# Altium project ServoController_ADVersion.PrjPcb
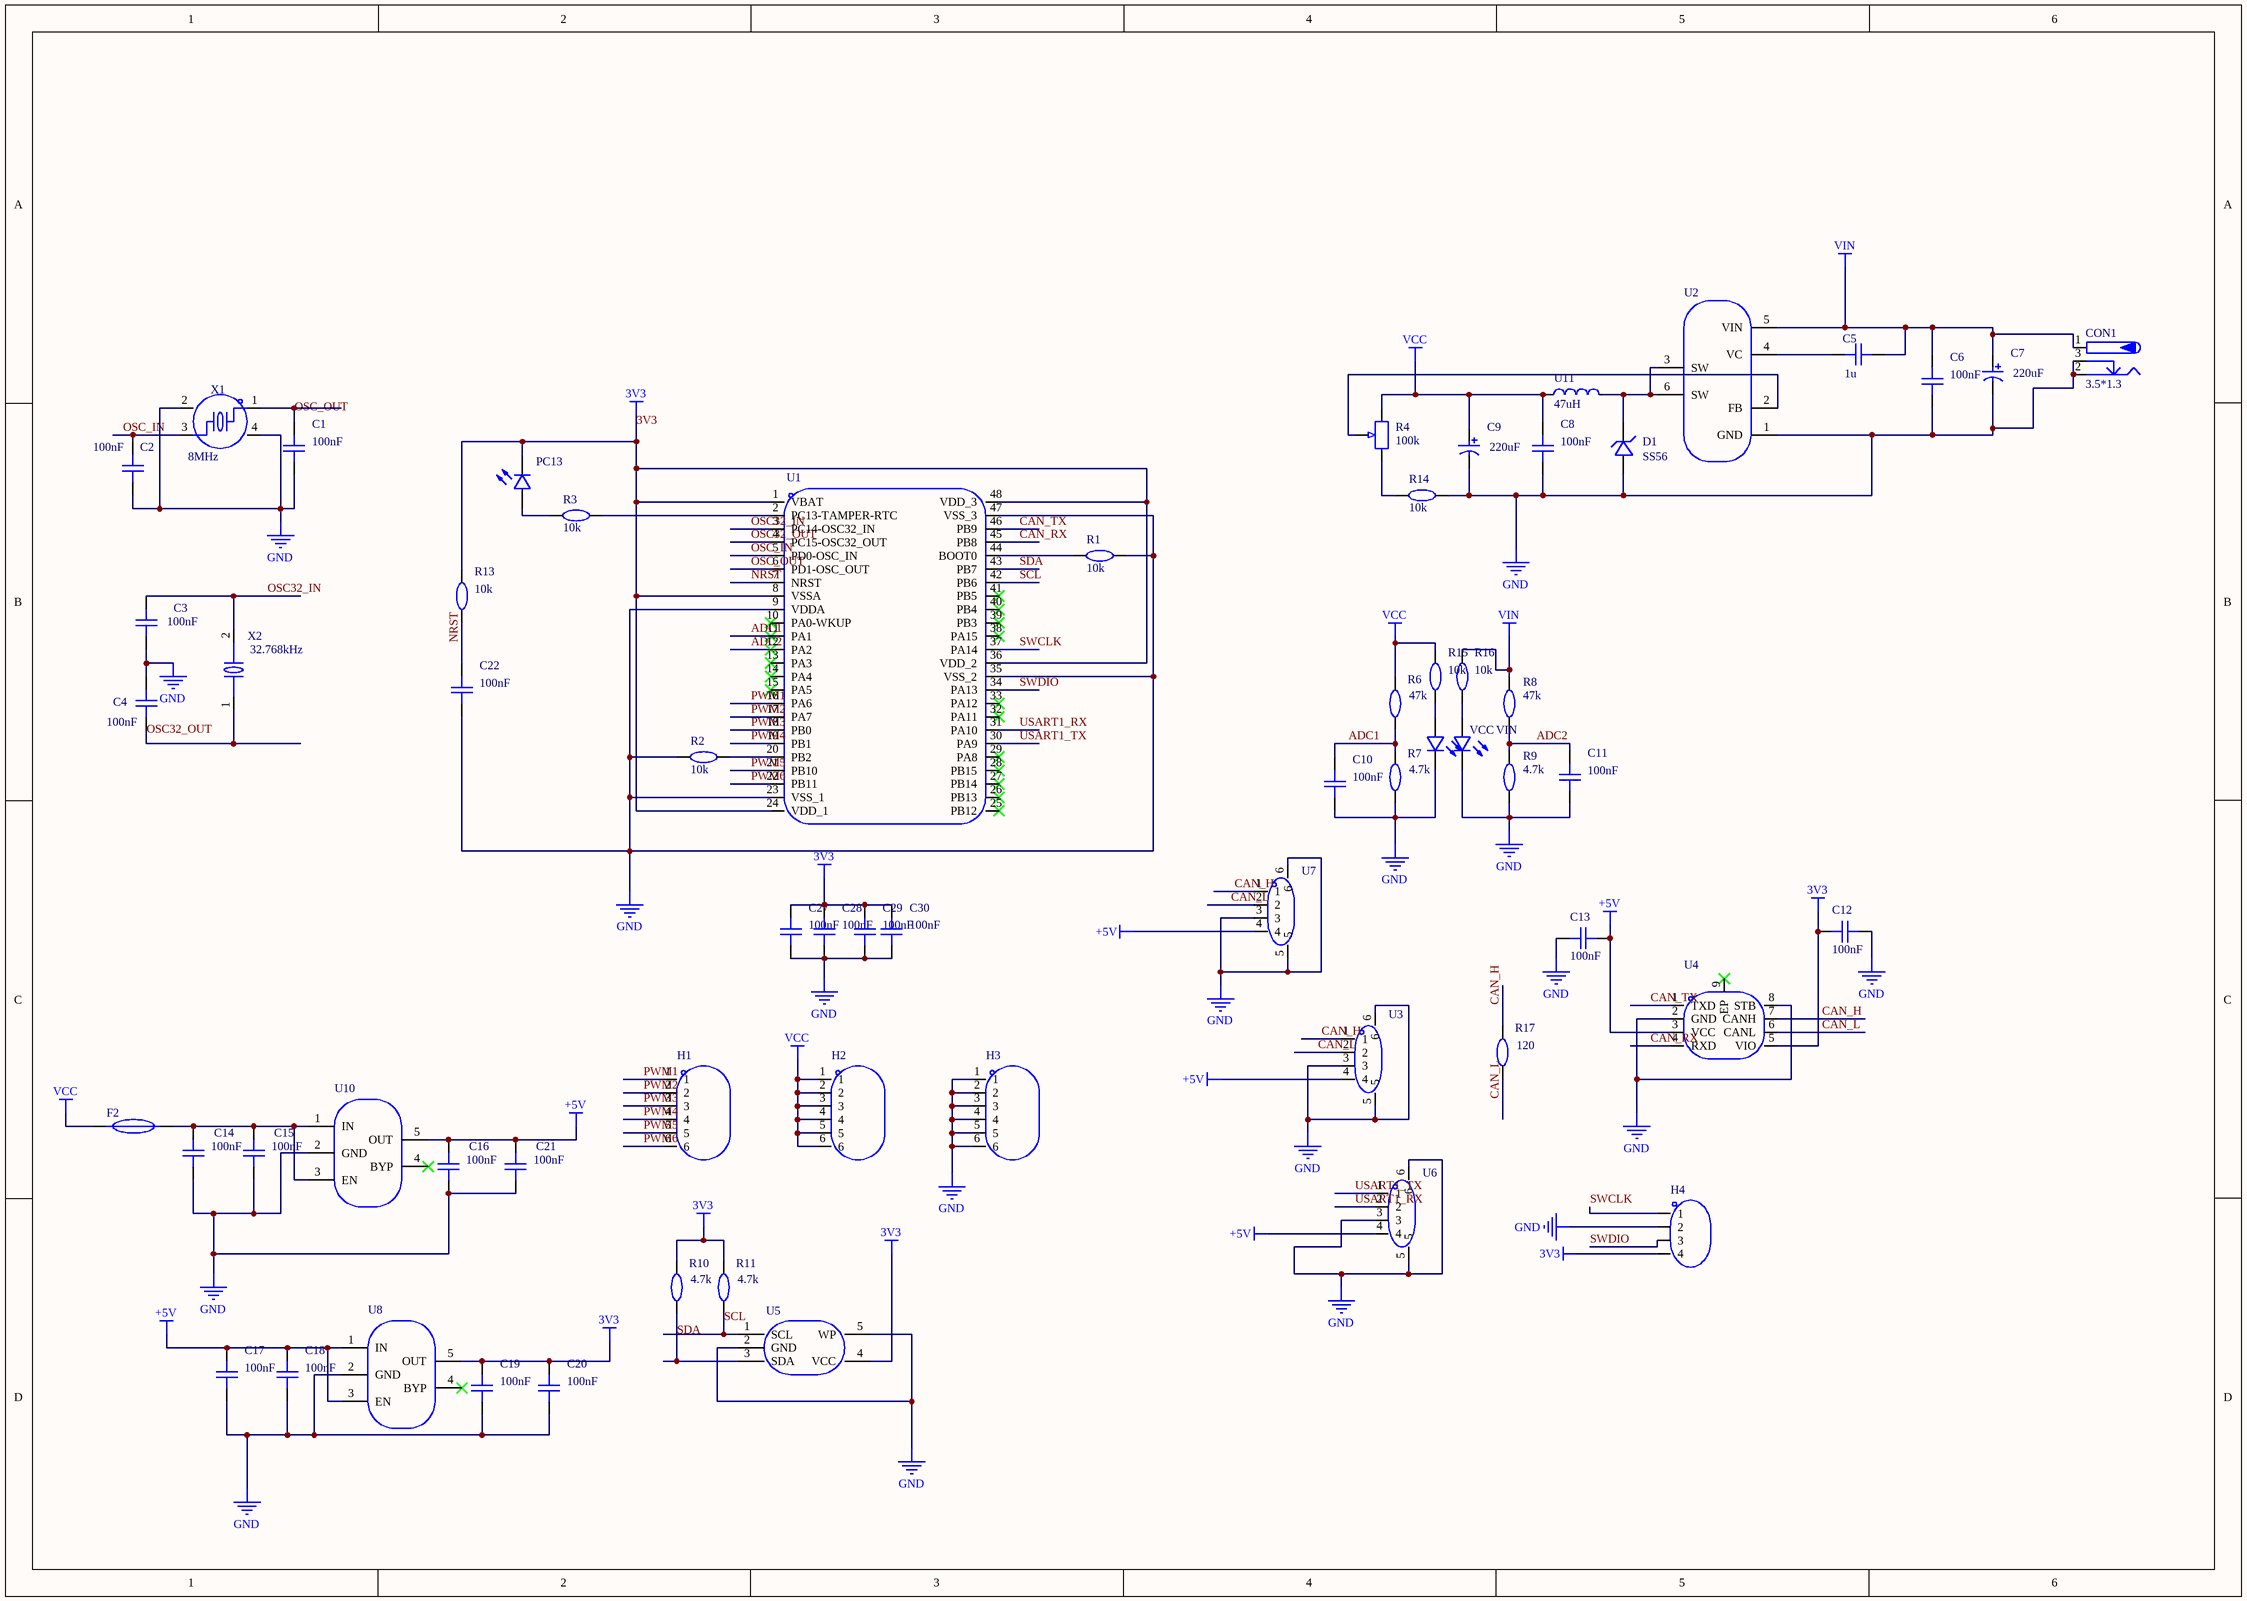
[diagram p0: 1_P1.schdoc]
1 sheet, 63 parts. Net scope: global (net labels, ports and power ports of the same name join across sheets).
Board file: PCB.PcbDoc

## Sheet 1_P1.schdoc
size 423 x 300 mm; SheetNumber: 1; SheetTotal: 1

### Parts
C1  value 100nF  [C0603_M]
C2  value 100nF  [C0603_M]
C3  value 100nF  [C0603_M]
C4  value 100nF  [C0603_M]
C5  value 1u  [C0603_M]
C6  value 100nF  [C0603_M]
C7  value 220uF  [CE D(6.3*5.4)]
C8  value 100nF  [C0603_M]
C9  value 220uF  [CE D(6.3*5.4)]
C10  value 100nF  [C0603_M]
C11  value 100nF  [C0603_M]
C12  value 100nF  [C0603_M]
C13  value 100nF  [C0603_M]
C14  value 100nF  [C0603_M]
C15  value 100nF  [C0603_M]
C16  value 100nF  [C0603_M]
C17  value 100nF  [C0603_M]
C18  value 100nF  [C0603_M]
C19  value 100nF  [C0603_M]
C20  value 100nF  [C0603_M]
C21  value 100nF  [C0603_M]
C22  value 100nF  [C0603_M]
C27  value 100nF  [C0603_M]
C28  value 100nF  [C0603_M]
C29  value 100nF  [C0603_M]
C30  value 100nF  [C0603_M]
CON1  3.5*1.3  [DC-005]
D1  LCSC Part Name: SS56  [SMA]
F2  (no value)  [FU 1206]
H1  (no value)  [HDR2.54-LI-6P]
H2  (no value)  [HDR2.54-LI-6P]
H3  (no value)  [HDR2.54-LI-6P]
H4  (no value)  [HDR2.54-LI-4P]
PC13  (no value)  [LED0603_R]
R1  value 10k  [R0603_M]
R2  value 10k  [R0603_M]
R3  value 10k  [R0603_M]
R4  value 100k  [3296W]
R6  value 47k  [R0603_M]
R7  value 4.7k  [R0603_M]
R8  value 47k  [R0603_M]
R9  value 4.7k  [R0603_M]
R10  value 4.7k  [R0603_M]
R11  value 4.7k  [R0603_M]
R13  value 10k  [R0603_M]
R14  value 10k  [R0603_M]
R15  value 10k  [R0603_M]
R16  value 10k  [R0603_M]
R17  value 120  [R0603_M]
U1  (no value)  [LQFP48-7*7]
U2  (no value)  [TO263-5]
U3  (no value)  [MX1.25-WT-4P]
U4  (no value)  [HVSON-8]
U5  (no value)  [SOT-23-5]
U6  (no value)  [MX1.25-WT-4P]
U7  (no value)  [MX1.25-WT-4P]
U8  (no value)  [SOT-23-5]
U10  (no value)  [SOT-23-5]
U11  value 47uH  [SLT040125]
VCC  (no value)  [LED0603_R]
VIN  (no value)  [LED0603_R]
X1  value 8MHz  [OSC-3225-4P]
X2  value 32.768kHz  [OSC-3215-2P]

### Nets
3V3: C12.1 C19.2 C20.2 C27.2 C28.2 C29.2 C30.2 H4.4 PC13.2(C) R10.2 R11.2 R13.2 U1.1(VBAT) U1.8(VSSA) U1.24(VDD_1) U1.36(VDD_2) U1.48(VDD_3) U4.5(VIO) U5.4(VCC) U8.5(OUT)
+5V: C13.2 C16.2 C17.2 C18.2 C21.2 U3.4 U4.3(VCC) U6.4 U7.4 U8.1(IN) U8.3(EN) U10.5(OUT)
GND: C1.1 C2.1 C3.1 C4.1 C6.1 C7.2 C8.1 C9.2 C10.1 C11.1 C12.2 C13.1 C14.1 C15.1 C16.1 C17.1 C18.1 C19.1 C20.1 C21.1 C22.1 C27.1 C28.1 C29.1 C30.1 CON1.2 CON1.3 D1.2(A) H3.1 H3.2 H3.3 H3.4 H3.5 H3.6 H4.2 R1.2 R2.1 R7.1 R9.1 R14.2 U1.9(VDDA) U1.23(VSS_1) U1.35(VSS_2) U1.47(VSS_3) U2.1(GND) U3.3 U3.5 U3.6 U4.2(GND) U4.8(STB) U5.2(GND) U5.5(WP) U6.3 U6.5 U6.6 U7.3 U7.5 U7.6 U8.2(GND) U10.2(GND) VCC.2(C) VIN.2(C) X1.2(GND) X1.4(GND)
VCC: C8.2 C9.1 F2.1 H2.1 H2.2 H2.3 H2.4 H2.5 H2.6 R4.3 R6.2 R15.2 U11.1
VIN: C5.1 C6.2 C7.1 CON1.1 R8.2 R16.2 U2.5(VIN)
ADC1: C10.2 R6.1 R7.2 U1.11(PA1)
ADC2: C11.2 R8.1 R9.2 U1.12(PA2)
CAN_H: R17.2 U3.1 U4.7(CANH) U7.1
CAN_L: R17.1 U3.2 U4.6(CANL) U7.2
CAN_RX: U1.45(PB8) U4.4(RXD)
CAN_TX: U1.46(PB9) U4.1(TXD)
NRST: C22.2 R13.1 U1.7(NRST)
OSC32_IN: C3.2 U1.3(PC14-OSC32_IN) X2.2
OSC32_OUT: C4.2 U1.4(PC15-OSC32_OUT) X2.1
OSC_IN: C2.2 U1.5(PD0-OSC_IN) X1.3
OSC_OUT: C1.2 U1.6(PD1-OSC_OUT) X1.1
PWM1: H1.1 U1.16(PA6)
PWM2: H1.2 U1.17(PA7)
PWM3: H1.3 U1.18(PB0)
PWM4: H1.4 U1.19(PB1)
PWM5: H1.5 U1.21(PB10)
PWM6: H1.6 U1.22(PB11)
SCL: R11.1 U1.42(PB6) U5.1(SCL)
SDA: R10.1 U1.43(PB7) U5.3(SDA)
SWCLK: H4.1 U1.37(PA14)
SWDIO: H4.3 U1.34(PA13)
USART1_RX: U1.31(PA10) U6.2
USART1_TX: U1.30(PA9) U6.1
NetC5_2: C5.2 U2.4(VC)
NetC14_2: C14.2 C15.2 F2.2 U10.1(IN) U10.3(EN)
NetD1_1: D1.1(C) U2.3(SW) U2.6(SW) U11.2
NetPC13_1: PC13.1(A) R3.1
NetR1_1: R1.1 U1.44(BOOT0)
NetR2_2: R2.2 U1.20(PB2)
NetR3_2: R3.2 U1.2(PC13-TAMPER-RTC)
NetR4_1: R4.1 R14.1
NetR4_2: R4.2 U2.2(FB)
NetR15_1: R15.1 VCC.1(A)
NetR16_1: R16.1 VIN.1(A)

Not connected (* = marked no-connect by the designer): U1 10(PA0-WKUP)* 13(PA3)* 14(PA4)* 15(PA5)* 25(PB12)* 26(PB13)* 27(PB14)* 28(PB15)* 29(PA8)* 32(PA11)* 33(PA12)* 38(PA15)* 39(PB3)* 40(PB4)* 41(PB5)*; U4 9(EP)*; U8 4(BYP)*; U10 4(BYP)*

### Library data of the parts
C1-C6 C8 C10-C22 C27-C30 = CC0603KRX7R9BB104: Manufacturer: YAGEO(国巨); Add into BOM: yes; Tolerance: ±10%; Voltage Rated: 50V; Temperature Coefficient: X7R; Symbol: CC0603KRX7R9BB104; Device: CC0603KRX7R9BB104; LCSC Part Name: 100nF ±10% 50V; Supplier Part: C14663; Manufacturer Part: CC0603KRX7R9BB104; Supplier Footprint: 0603; JLCPCB Part Class: Basic Part; Datasheet: https://atta.szlcsc.com/upload/public/pdf/source/20170116/1484561234239.pdf; Supplier: LCSC; Convert to PCB: yes
C7 C9 = 50SEV10M6.3X5.5: Manufacturer: rubycon(红宝石); Add into BOM: yes; Tolerance: ±20%; Rated Voltage: 50V; φD: 6.3mm; L: 5.5mm; Lifetime @ Temp: 2000hrs@85; Symbol: 50SEV10M6.3X5.5; Device: 50SEV10M6.3X5.5; LCSC Part Name: 10uF ±20% 50V; Supplier Part: C88809; Manufacturer Part: 50SEV10M6.3X5.5; Supplier Footprint: SMD,6.3x5.5mm; JLCPCB Part Class: Extended Part; Datasheet: https://atta.szlcsc.com/upload/public/pdf/source/20161125/1480067898590.pdf; Supplier: LCSC; Convert to PCB: yes; Ripple Current: -; Equivalent Series Resistance(ESR): -; Operating Temperature: -40~+85
CON1 = P-DC: 低压电源接口; BOM名称: DC电源接口; 联系卖家，免费技术支持: 唯一出售店铺网址https://shop463601444.taobao.com
D1 = SS56_C379835: Add into BOM: yes; Symbol: SS56_C379835; Device: SS56_C379835; Supplier Part: C379835; Manufacturer Part: SS56; Supplier Footprint: SMA; JLCPCB Part Class: Extended Part; Datasheet: https://atta.szlcsc.com/upload/public/pdf/source/20190403/C379835_A6104CE7F1A63165C53675BFBA3A1721.pdf; Supplier: LCSC; Convert to PCB: yes
F2 = JK-nSMD050-30: Manufacturer: JK(金科); Symbol: JK-NSMD050-30V; Add into BOM: yes; Operating Voltage (Max): 30V; Current Rating (Max): 100A; Hold Current: 500mA; Trip Current: 1A; Power Dissipation: 600mW; Resistance - Initial (Ri) (Min): 150m; Resistance - Post Trip (R1) (Max): 300m; Maximum Time to Trip: 100ms; Device: JK-nSMD050-30; LCSC Part Name: 0.5A 30V 1206 自恢复保险丝 PTC; Supplier Part: C720075; Manufacturer Part: JK-nSMD050-30; Supplier Footprint: 1206; JLCPCB Part Class: Extended Part; Datasheet: https://atta.szlcsc.com/upload/public/pdf/source/20200810/C720075_06AF2D4541537091880CC35F0EFB49F8.pdf; Supplier: LCSC; Convert to PCB: yes; Operating Temperature: -40~+85
H1-H3 = Z-211-0611-0021-001: Manufacturer: Nextron(台湾正凌); Add into BOM: yes; Pitch: 2.54mm; Symbol: Z-211-0611-0021-001; Device: Z-211-0611-0021-001; LCSC Part Name: 2.54mm; Supplier Part: C190819; Manufacturer Part: Z-211-0611-0021-001; Supplier Footprint: 插件,P=2.54mm; JLCPCB Part Class: Extended Part; Datasheet: https://atta.szlcsc.com/upload/public/pdf/source/20180731/C190819_A681B1380B379CDFC378560BE13D8C8F.pdf; Supplier: LCSC; Convert to PCB: yes; Number of Pins: 6; Number of Rows: 1; Pin Structure: -; Row Spacing: -; Mounting Type: 直插; Circluar Pins/Square Pins: -; Current Rating (Max): -; Voltage Rating (Max): -; Length of Mating Pin: -; Insulation Height: -; Contact Material: 黄铜; Contact Plating: -; Color: 黑色
H4 = B-2100S04P-A110: Manufacturer: Ckmtw(灿科盟); Symbol: Header-Male-2.54_1x4; Add into BOM: yes; Pitch: 2.54mm; Pin Structure: 1x4P; Device: B-2100S04P-A110; LCSC Part Name: 2.54mm 1x4P; Supplier Part: C124378; Manufacturer Part: B-2100S04P-A110; Supplier Footprint: 插件,P=2.54mm; JLCPCB Part Class: Extended Part; Datasheet: https://atta.szlcsc.com/upload/public/pdf/source/20170821/C124378_1503303307508901532.pdf; Supplier: LCSC; Convert to PCB: yes; Number of Pins: 4; Number of Rows: 1; Row Spacing: -; Mounting Type: 直插; Circluar Pins/Square Pins: -; Current Rating (Max): -; Voltage Rating (Max): -; Length of Mating Pin: 6mm; Insulation Height: 2.54mm; Length of End Connection Pin: 3mm; Contact Material: 黄铜; Contact Plating: -; Operating Temperature Range: -40~+105; Color: 黑色
PC13 VCC VIN = 19-217/GHC-YR1S2/3T: Manufacturer: EVERLIGHT(台湾亿光); Add into BOM: yes; Emitted Color: 翠绿; Lens Color: 无色透明; Dominant Wavelength: 520nm~535nm; Peak Wavelength: 518nm; Forward Current: 20mA; Forward Voltage (VF): 3.3V; Luminous Intensity: 285mcd; Power Dissipation: 110mW; Viewing Angle: 120°; Symbol: 19-217/GHC-YR1S2/3T; Device: 19-217/GHC-YR1S2/3T; LCSC Part Name: 翠绿LED; Supplier Part: C72043; Manufacturer Part: 19-217/GHC-YR1S2/3T; Supplier Footprint: 0603; JLCPCB Part Class: Basic Part; Datasheet: https://atta.szlcsc.com/upload/public/pdf/source/20160507/1462613613780.pdf; Supplier: LCSC; Convert to PCB: yes; Diode Configuration: -; Color Temperature: -; Luminous Flux (@25℃): -; Mounting Sytle: -; Operating Temperature: -40~+85
R1-R3 R6-R9 = RC-01W1002FT: Manufacturer: FH(风华); Add into BOM: yes; Tolerance: ±1%; Power(Watts): 50mW; Temperature Coefficient: ±200ppm/; Overload Voltage (Max): 25V; Symbol: RC-01W1002FT; Device: RC-01W1002FT; LCSC Part Name: 10k ±1%; Supplier Part: C304501; Manufacturer Part: RC-01W1002FT; Supplier Footprint: 0201; JLCPCB Part Class: Extended Part; Datasheet: https://atta.szlcsc.com/upload/public/pdf/source/20181030/C304501_FF38550671994E5E8FB5233A4E4A9820.pdf; Supplier: LCSC; Convert to PCB: yes; Operating Temperature Range: -55~+125
R4 = 3296W-1-104: Manufacturer: BOCHEN(博晨); Add into BOM: yes; Tolerance: ±10%; Temperature Coefficient: ±250ppm/; Symbol: 3296W-1-104; Device: 3296W-1-104; LCSC Part Name: 100k ±10%; Supplier Part: C118963; Manufacturer Part: 3296W-1-104; Supplier Footprint: 插件; JLCPCB Part Class: Extended Part; Datasheet: https://atta.szlcsc.com/upload/public/pdf/source/20171114/C118963_15106326662041117450.pdf; Supplier: LCSC; Convert to PCB: yes
R10 R11 R13-R17 = TR0603B10K0P0525Z: Manufacturer: EVER OHMS(天二科技); Symbol: TR0603B10KP05250.1W; Add into BOM: yes; Tolerance: ±0.1%; Power(Watts): 100mW; Temperature Coefficient: ±25ppm/; Overload Voltage (Max): 75V; Device: TR0603B10K0P0525Z; LCSC Part Name: 10k ±0.1% 100mW; Supplier Part: C188363; Manufacturer Part: TR0603B10K0P0525Z; Supplier Footprint: 0603; JLCPCB Part Class: Extended Part; Datasheet: https://atta.szlcsc.com/upload/public/pdf/source/20190415/C188363_433BF05B6FB8F7A0F5F35A3E4390C55A.pdf; Supplier: LCSC; Convert to PCB: yes; Type: 薄膜电阻; Operating Temperature Range: -55~+155
U1 = STM32F103C8T6: Manufacturer: ST(意法半导体); Add into BOM: yes; Speed: 72MHz; Voltage - Supply (Vcc/Vdd): 2V ~ 3.6V; Program Memory Size: 64KB; RAM Size: 20KB; Number of I/O: 37; A/D: 10x12bit; PWM: 13; UART/USART: 3 USART; I2C（SMBUS/PMBUS）: 2; USB Device: 1; Symbol: STM32F103C8T6; Device: STM32F103C8T6; LCSC Part Name: STM32F103C8T6; Supplier Part: C8734; Manufacturer Part: STM32F103C8T6; Supplier Footprint: LQFP-48_7x7x05P; JLCPCB Part Class: Basic Part; Datasheet: https://atta.szlcsc.com/upload/public/pdf/source/20140724/1457707174202.pdf; Supplier: LCSC; Convert to PCB: yes; CAN: 1
U2 = XL4015E1: Manufacturer: XLSEMI(芯龙); Add into BOM: yes; Function: 降压型; Symbol: XL4015E1; Device: XL4015E1; LCSC Part Name: 降压型; Supplier Part: C51661; Manufacturer Part: XL4015E1; Supplier Footprint: TO-263-5; JLCPCB Part Class: Extended Part; Datasheet: https://atta.szlcsc.com/upload/public/pdf/source/20150618/1457707323461.pdf; Supplier: LCSC; Convert to PCB: yes; Synchronous Rectification: -; Number of Outputs: -; Topology: -; Input Voltage: -; Output Current (Max): -; Switching Frequency: -
U3 U6 U7 = XH2.5-4P-LS_1: Add into BOM: yes; Symbol: XH2.5-4P-LS; Device: XH2.5-4P-LS_1; LCSC Part Name: XH2.5-4P-LS; Supplier Part: C9900001834; Manufacturer Part: XH2.5-4P-LS; Supplier Footprint: SMD_XH2.5-4P-LS; JLCPCB Part Class: Extended Part; Datasheet: 2021-11-13/272192A/916e3be17c0c414ab50f4328a8cee917/254立贴承认书.pdf; Supplier: LCSC; Convert to PCB: yes
U4 = SIT1042TK/3: Manufacturer: SIT(芯力特); Add into BOM: yes; Symbol: SIT1042TK/3; Device: SIT1042TK/3; LCSC Part Name: CAN收发器芯片; Supplier Part: C1121845; Manufacturer Part: SIT1042TK/3; Supplier Footprint: HVSON-8; JLCPCB Part Class: Extended Part; Datasheet: https://atta.szlcsc.com/upload/public/pdf/source/20201217/C1121843_88798D5AA5E17D4FE8882F968B4CCD4F.pdf; Supplier: LCSC; Convert to PCB: yes; Type: -; Protocol: -; Number of Drivers/Receivers: -; Data Rate: -; Supply Voltage: -
U5 = K24C02_1: Manufacturer: 华虹宏力; Symbol: K24C02; Add into BOM: yes; Memory Format: EEPROM; Memory Size: 2Kb (256 x 8); Memory Interface: I2C; Voltage - Supply: 1.8V ~ 5.5V; Device: K24C02_1; LCSC Part Name: K24C02; Supplier Part: C84964; Manufacturer Part: K24C02; Supplier Footprint: SOT-23-5; JLCPCB Part Class: Extended Part; Datasheet: https://atta.szlcsc.com/upload/public/pdf/source/20161024/1477288693549.pdf; Supplier: LCSC; Convert to PCB: yes
U8 = SPX3819M5-L-5-0/TR: Manufacturer: MaxLinear; Add into BOM: yes; Output Type: 固定; Output Polarity: 正; Number of Outputs: 1; Maximum Input Voltage: 16V; Output Voltage: 5V; Dropout Voltage: 700mV@(500mA); Output Current: 500mA; Symbol: SPX3819M5-L-5-0/TR; Device: SPX3819M5-L-5-0/TR; LCSC Part Name: Vin=16V Vout=5V 500mA; Supplier Part: C13417; Manufacturer Part: SPX3819M5-L-5-0/TR; Supplier Footprint: SOT-23-5; JLCPCB Part Class: Extended Part; Datasheet: https://atta.szlcsc.com/upload/public/pdf/source/20150720/1457707331934.pdf; Supplier: LCSC; Convert to PCB: yes; Power Supply Rejection Ratio (PRSS): -
U10 = SPX3819M5-L-3-3/TR: Manufacturer: MaxLinear; Add into BOM: yes; Output Type: 固定; Output Polarity: 正; Number of Outputs: 1; Maximum Input Voltage: 16V; Output Voltage: 3.3V; Dropout Voltage: 700mV@(500mA); Output Current: 500mA; Power Supply Rejection Ratio (PRSS): 70dB; Symbol: SPX3819M5-L-3-3/TR; Device: SPX3819M5-L-3-3/TR; LCSC Part Name: Vin=16V Vout=3.3V 500mA 70dB; Supplier Part: C9055; Manufacturer Part: SPX3819M5-L-3-3/TR; Supplier Footprint: SOT-23-5; JLCPCB Part Class: Extended Part; Datasheet: https://atta.szlcsc.com/upload/public/pdf/source/20160421/1461205045150.pdf; Supplier: LCSC; Convert to PCB: yes
U11 = SLT040125T470MUB: Manufacturer: Sunltech(韩国顺磁); Add into BOM: yes; Tolerance: ±20%; Rated Current: 2A; DC Resistance: 42m; Symbol: SLT040125T470MUB; Device: SLT040125T470MUB; LCSC Part Name: 47uH ±20% 2A 42m; Supplier Part: C326002; Manufacturer Part: SLT040125T470MUB; Supplier Footprint: 插件; JLCPCB Part Class: Extended Part; Datasheet: https://atta.szlcsc.com/upload/public/pdf/source/20181123/C326002_261DE052296031ED64330EFF6DF1C136.pdf; Supplier: LCSC; Convert to PCB: yes; Type: 磁环电感; Current - Saturation (Isat): -; Q @ Frequency: -; Frequency - Self Resonant: -; Ratings: -; Lead Spacing: -
X1 = X32258MSB4SI: Manufacturer: YXC扬兴科技; Add into BOM: yes; Crystal Type: 贴片无源晶振; Frequency Tolerance: ±10ppm; Frequency Stability: ±30ppm; Load Capacitance: 20pF; Symbol: X32258MSB4SI; Device: X32258MSB4SI; LCSC Part Name: 8MHz ±10ppm 20pF; Supplier Part: C2682774; Manufacturer Part: X32258MSB4SI; Supplier Footprint: SMD3225-4P; JLCPCB Part Class: Extended Part; Datasheet: https://atta.szlcsc.com/upload/public/pdf/source/20210106/C2682774_0CD4FDA5D9DA3FBEEC23BD607A48E4B0.pdf; Supplier: LCSC; Convert to PCB: yes; Operating Temperature: -40~+85
X2 = G3100327072070CY: Manufacturer: JGHC(晶光华); Add into BOM: yes; Crystal Type: 贴片无源晶振; Frequency Tolerance: ±20ppm; Load Capacitance: 7pF; Equivalent Series Resistance (ESR): 70k; Symbol: G3100327072070CY; Device: G3100327072070CY; LCSC Part Name: 32.768kHz ±20ppm 7pF; Supplier Part: C909615; Manufacturer Part: G3100327072070CY; Supplier Footprint: SMD3215-2P; JLCPCB Part Class: Extended Part; Datasheet: https://atta.szlcsc.com/upload/public/pdf/source/20201023/C909615_5CB83FDF197FE73AFEAD0F20FB1E7116.pdf; Supplier: LCSC; Convert to PCB: yes; Frequency Stability: -; Operating Temperature: -40~+85